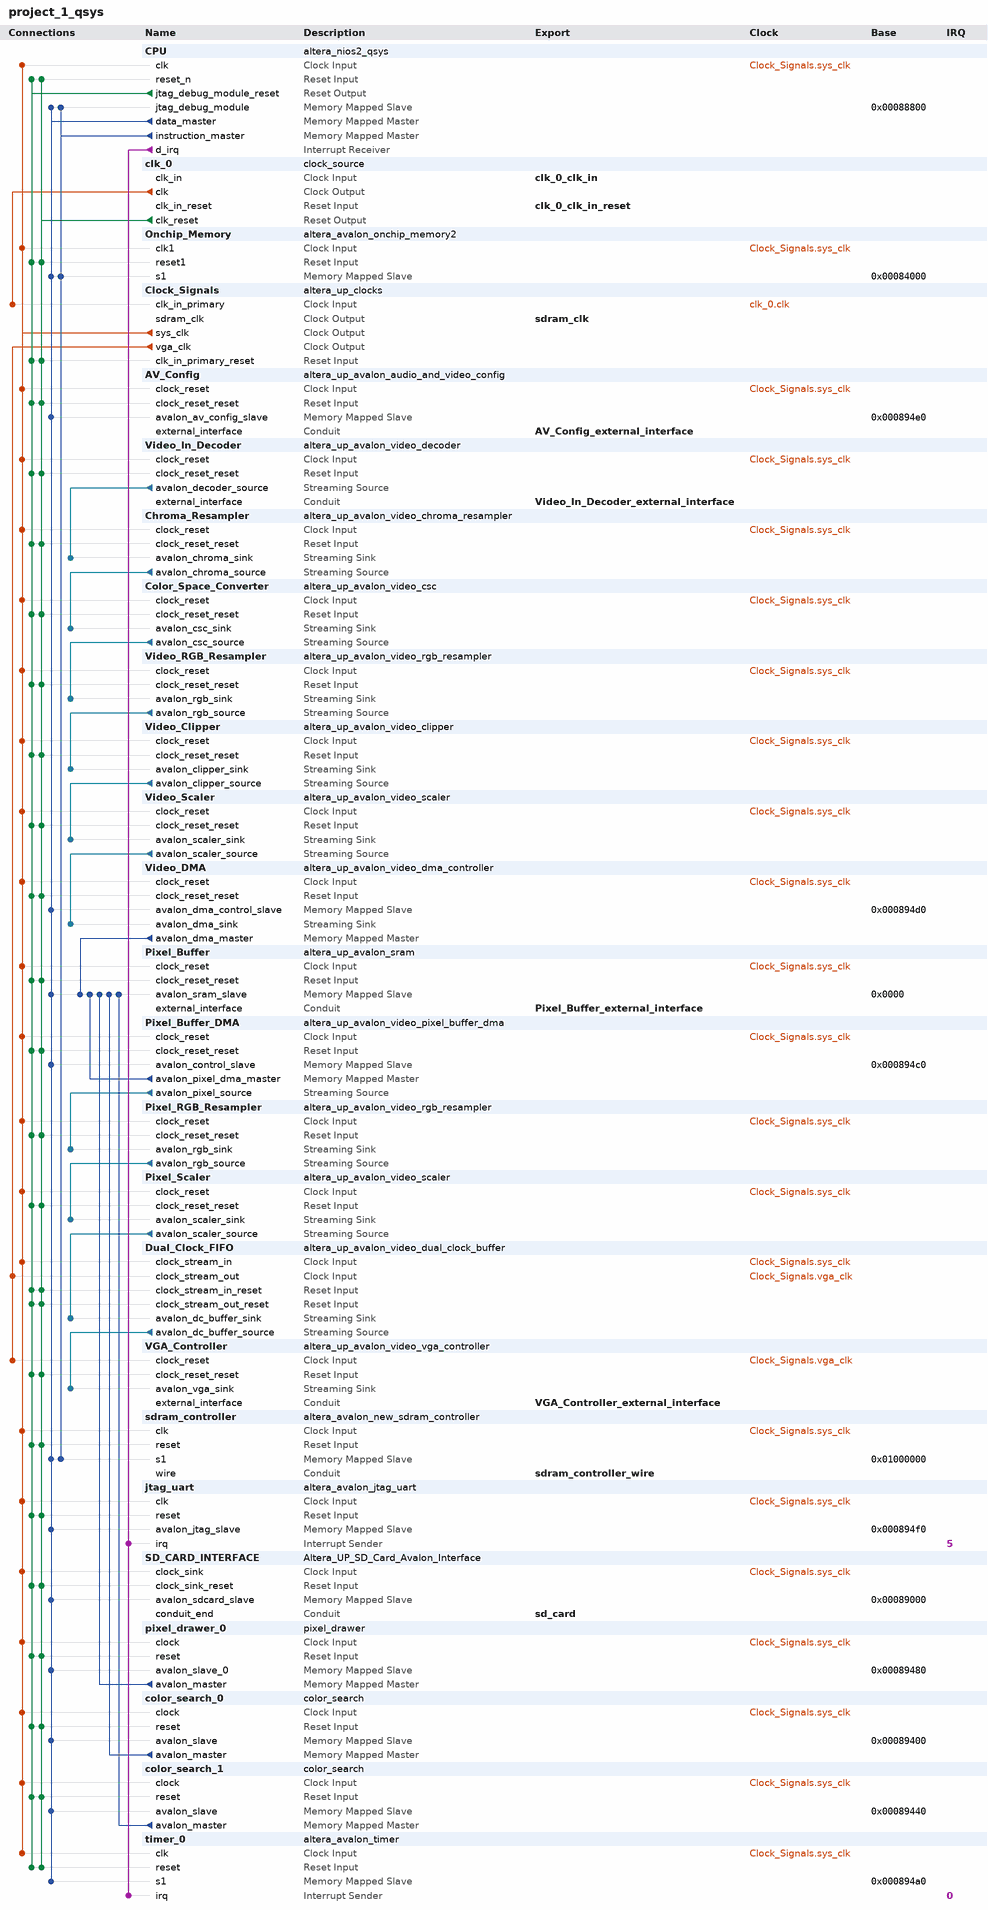
[diagram p0: system contents]
# Platform Designer (Qsys) system project_1_qsys, Cyclone II EP2C35F672C6
# Parameters at their usual value, and those the tool derives, are not listed.
package require -exact qsys 13.0
create_system project_1_qsys
set_project_property DEVICE_FAMILY {Cyclone II}
set_project_property DEVICE EP2C35F672C6

add_instance CPU altera_nios2_qsys 13.0
set_instance_parameter_value CPU manuallyAssignCpuID false
set_instance_parameter_value CPU resetSlave sdram_controller.s1
set_instance_parameter_value CPU exceptionSlave sdram_controller.s1
set_instance_parameter_value CPU breakSlave CPU.jtag_debug_module
set_instance_parameter_value CPU impl Fast
set_instance_parameter_value CPU icache_size 4096

add_instance clk_0 clock_source 13.0
set_instance_parameter_value clk_0 clockFrequency 50000000

add_instance Onchip_Memory altera_avalon_onchip_memory2 13.0.1.99.2
set_instance_parameter_value Onchip_Memory dataWidth 32
set_instance_parameter_value Onchip_Memory dualPort false
set_instance_parameter_value Onchip_Memory initMemContent true
set_instance_parameter_value Onchip_Memory initializationFileName Onchip_Memory
set_instance_parameter_value Onchip_Memory memorySize 16384

add_instance Clock_Signals altera_up_clocks 13.0
set_instance_parameter_value Clock_Signals board DE2
set_instance_parameter_value Clock_Signals vga_clk true
set_instance_parameter_value Clock_Signals audio_clk false
set_instance_parameter_value Clock_Signals audio_clk_freq 12.288

add_instance AV_Config altera_up_avalon_audio_and_video_config 13.0
set_instance_parameter_value AV_Config board DE2
set_instance_parameter_value AV_Config audio_in {Microphone to ADC}
set_instance_parameter_value AV_Config line_in_bypass false
set_instance_parameter_value AV_Config bit_length 24
set_instance_parameter_value AV_Config sampling_rate {48 kHz}

add_instance Video_In_Decoder altera_up_avalon_video_decoder 13.0

add_instance Chroma_Resampler altera_up_avalon_video_chroma_resampler 13.0

add_instance Color_Space_Converter altera_up_avalon_video_csc 13.0

add_instance Video_RGB_Resampler altera_up_avalon_video_rgb_resampler 13.0
set_instance_parameter_value Video_RGB_Resampler input_type {24-bit RGB}
set_instance_parameter_value Video_RGB_Resampler output_type {16-bit RGB}
set_instance_parameter_value Video_RGB_Resampler alpha 255

add_instance Video_Clipper altera_up_avalon_video_clipper 13.0
set_instance_parameter_value Video_Clipper color_bits 16
set_instance_parameter_value Video_Clipper color_planes 1

add_instance Video_Scaler altera_up_avalon_video_scaler 13.0
set_instance_parameter_value Video_Scaler width_scaling 0.5
set_instance_parameter_value Video_Scaler height_scaling 1
set_instance_parameter_value Video_Scaler width_in 640
set_instance_parameter_value Video_Scaler color_bits 16
set_instance_parameter_value Video_Scaler color_planes 1

add_instance Video_DMA altera_up_avalon_video_dma_controller 13.0
set_instance_parameter_value Video_DMA mode {From Stream to Memory}
set_instance_parameter_value Video_DMA addr_mode X-Y
set_instance_parameter_value Video_DMA start_address 0
set_instance_parameter_value Video_DMA back_start_address 0
set_instance_parameter_value Video_DMA width 320
set_instance_parameter_value Video_DMA height 240
set_instance_parameter_value Video_DMA color_bits 16
set_instance_parameter_value Video_DMA color_planes 1
set_instance_parameter_value Video_DMA dma_enabled true

add_instance Pixel_Buffer altera_up_avalon_sram 13.0
set_instance_parameter_value Pixel_Buffer board DE2
set_instance_parameter_value Pixel_Buffer pixel_buffer true

add_instance Pixel_Buffer_DMA altera_up_avalon_video_pixel_buffer_dma 13.0
set_instance_parameter_value Pixel_Buffer_DMA addr_mode X-Y
set_instance_parameter_value Pixel_Buffer_DMA start_address 0
set_instance_parameter_value Pixel_Buffer_DMA back_start_address 0
set_instance_parameter_value Pixel_Buffer_DMA image_width 320
set_instance_parameter_value Pixel_Buffer_DMA image_height 240
set_instance_parameter_value Pixel_Buffer_DMA color_space {16-bit RGB}

add_instance Pixel_RGB_Resampler altera_up_avalon_video_rgb_resampler 13.0
set_instance_parameter_value Pixel_RGB_Resampler input_type {16-bit RGB}
set_instance_parameter_value Pixel_RGB_Resampler output_type {30-bit RGB}
set_instance_parameter_value Pixel_RGB_Resampler alpha 255

add_instance Pixel_Scaler altera_up_avalon_video_scaler 13.0
set_instance_parameter_value Pixel_Scaler width_scaling 2
set_instance_parameter_value Pixel_Scaler height_scaling 2
set_instance_parameter_value Pixel_Scaler width_in 320
set_instance_parameter_value Pixel_Scaler color_bits 10
set_instance_parameter_value Pixel_Scaler color_planes 3

add_instance Dual_Clock_FIFO altera_up_avalon_video_dual_clock_buffer 13.0
set_instance_parameter_value Dual_Clock_FIFO color_bits 10

add_instance VGA_Controller altera_up_avalon_video_vga_controller 13.0
set_instance_parameter_value VGA_Controller board DE2

add_instance sdram_controller altera_avalon_new_sdram_controller 13.0.1.99.2
set_instance_parameter_value sdram_controller TAC 5.5
set_instance_parameter_value sdram_controller TRCD 20.0
set_instance_parameter_value sdram_controller TRP 20.0
set_instance_parameter_value sdram_controller casLatency 3
set_instance_parameter_value sdram_controller columnWidth 8
set_instance_parameter_value sdram_controller dataWidth 16
set_instance_parameter_value sdram_controller generateSimulationModel false
set_instance_parameter_value sdram_controller model single_Micron_MT48LC4M32B2_7_chip
set_instance_parameter_value sdram_controller numberOfBanks 4
set_instance_parameter_value sdram_controller numberOfChipSelects 1
set_instance_parameter_value sdram_controller powerUpDelay 100.0
set_instance_parameter_value sdram_controller refreshPeriod 15.625
set_instance_parameter_value sdram_controller rowWidth 12

add_instance jtag_uart altera_avalon_jtag_uart 13.0.1.99.2
set_instance_parameter_value jtag_uart simInteractiveOptions NO_INTERACTIVE_WINDOWS

add_instance SD_CARD_INTERFACE Altera_UP_SD_Card_Avalon_Interface 13.0

add_instance pixel_drawer_0 pixel_drawer 1.0
set_instance_parameter_value pixel_drawer_0 pixel_buffer_base 0

add_instance color_search_0 color_search 1.0
set_instance_parameter_value color_search_0 pixel_buffer_base 0
set_instance_parameter_value color_search_0 find_color 0
set_instance_parameter_value color_search_0 block_size 2
set_instance_parameter_value color_search_0 score_factor 2

add_instance color_search_1 color_search 1.0
set_instance_parameter_value color_search_1 pixel_buffer_base 0
set_instance_parameter_value color_search_1 find_color 2
set_instance_parameter_value color_search_1 block_size 2
set_instance_parameter_value color_search_1 score_factor 2

add_instance timer_0 altera_avalon_timer 13.0.1.99.2
set_instance_parameter_value timer_0 period 1
set_instance_parameter_value timer_0 periodUnits MSEC

# connections
add_connection clk_0.clk Clock_Signals.clk_in_primary clock
add_connection Clock_Signals.sys_clk AV_Config.clock_reset clock
add_connection Clock_Signals.sys_clk Chroma_Resampler.clock_reset clock
add_connection Clock_Signals.sys_clk color_search_0.clock clock
add_connection Clock_Signals.sys_clk color_search_1.clock clock
add_connection Clock_Signals.sys_clk Color_Space_Converter.clock_reset clock
add_connection Clock_Signals.sys_clk CPU.clk clock
add_connection Clock_Signals.sys_clk Dual_Clock_FIFO.clock_stream_in clock
add_connection Clock_Signals.sys_clk jtag_uart.clk clock
add_connection Clock_Signals.sys_clk Onchip_Memory.clk1 clock
add_connection Clock_Signals.sys_clk Pixel_Buffer.clock_reset clock
add_connection Clock_Signals.sys_clk Pixel_Buffer_DMA.clock_reset clock
add_connection Clock_Signals.sys_clk pixel_drawer_0.clock clock
add_connection Clock_Signals.sys_clk Pixel_RGB_Resampler.clock_reset clock
add_connection Clock_Signals.sys_clk Pixel_Scaler.clock_reset clock
add_connection Clock_Signals.sys_clk SD_CARD_INTERFACE.clock_sink clock
add_connection Clock_Signals.sys_clk sdram_controller.clk clock
add_connection Clock_Signals.sys_clk timer_0.clk clock
add_connection Clock_Signals.sys_clk Video_Clipper.clock_reset clock
add_connection Clock_Signals.sys_clk Video_DMA.clock_reset clock
add_connection Clock_Signals.sys_clk Video_In_Decoder.clock_reset clock
add_connection Clock_Signals.sys_clk Video_RGB_Resampler.clock_reset clock
add_connection Clock_Signals.sys_clk Video_Scaler.clock_reset clock
add_connection Clock_Signals.vga_clk Dual_Clock_FIFO.clock_stream_out clock
add_connection Clock_Signals.vga_clk VGA_Controller.clock_reset clock
add_connection clk_0.clk_reset AV_Config.clock_reset_reset reset
add_connection clk_0.clk_reset Chroma_Resampler.clock_reset_reset reset
add_connection clk_0.clk_reset Clock_Signals.clk_in_primary_reset reset
add_connection clk_0.clk_reset color_search_0.reset reset
add_connection clk_0.clk_reset color_search_1.reset reset
add_connection clk_0.clk_reset Color_Space_Converter.clock_reset_reset reset
add_connection clk_0.clk_reset CPU.reset_n reset
add_connection clk_0.clk_reset Dual_Clock_FIFO.clock_stream_in_reset reset
add_connection clk_0.clk_reset Dual_Clock_FIFO.clock_stream_out_reset reset
add_connection clk_0.clk_reset jtag_uart.reset reset
add_connection clk_0.clk_reset Onchip_Memory.reset1 reset
add_connection clk_0.clk_reset Pixel_Buffer.clock_reset_reset reset
add_connection clk_0.clk_reset Pixel_Buffer_DMA.clock_reset_reset reset
add_connection clk_0.clk_reset pixel_drawer_0.reset reset
add_connection clk_0.clk_reset Pixel_RGB_Resampler.clock_reset_reset reset
add_connection clk_0.clk_reset Pixel_Scaler.clock_reset_reset reset
add_connection clk_0.clk_reset SD_CARD_INTERFACE.clock_sink_reset reset
add_connection clk_0.clk_reset sdram_controller.reset reset
add_connection clk_0.clk_reset timer_0.reset reset
add_connection clk_0.clk_reset VGA_Controller.clock_reset_reset reset
add_connection clk_0.clk_reset Video_Clipper.clock_reset_reset reset
add_connection clk_0.clk_reset Video_DMA.clock_reset_reset reset
add_connection clk_0.clk_reset Video_In_Decoder.clock_reset_reset reset
add_connection clk_0.clk_reset Video_RGB_Resampler.clock_reset_reset reset
add_connection clk_0.clk_reset Video_Scaler.clock_reset_reset reset
add_connection CPU.jtag_debug_module_reset AV_Config.clock_reset_reset reset
add_connection CPU.jtag_debug_module_reset Chroma_Resampler.clock_reset_reset reset
add_connection CPU.jtag_debug_module_reset Clock_Signals.clk_in_primary_reset reset
add_connection CPU.jtag_debug_module_reset color_search_0.reset reset
add_connection CPU.jtag_debug_module_reset color_search_1.reset reset
add_connection CPU.jtag_debug_module_reset Color_Space_Converter.clock_reset_reset reset
add_connection CPU.jtag_debug_module_reset CPU.reset_n reset
add_connection CPU.jtag_debug_module_reset Dual_Clock_FIFO.clock_stream_in_reset reset
add_connection CPU.jtag_debug_module_reset Dual_Clock_FIFO.clock_stream_out_reset reset
add_connection CPU.jtag_debug_module_reset jtag_uart.reset reset
add_connection CPU.jtag_debug_module_reset Onchip_Memory.reset1 reset
add_connection CPU.jtag_debug_module_reset Pixel_Buffer.clock_reset_reset reset
add_connection CPU.jtag_debug_module_reset Pixel_Buffer_DMA.clock_reset_reset reset
add_connection CPU.jtag_debug_module_reset pixel_drawer_0.reset reset
add_connection CPU.jtag_debug_module_reset Pixel_RGB_Resampler.clock_reset_reset reset
add_connection CPU.jtag_debug_module_reset Pixel_Scaler.clock_reset_reset reset
add_connection CPU.jtag_debug_module_reset SD_CARD_INTERFACE.clock_sink_reset reset
add_connection CPU.jtag_debug_module_reset sdram_controller.reset reset
add_connection CPU.jtag_debug_module_reset timer_0.reset reset
add_connection CPU.jtag_debug_module_reset VGA_Controller.clock_reset_reset reset
add_connection CPU.jtag_debug_module_reset Video_Clipper.clock_reset_reset reset
add_connection CPU.jtag_debug_module_reset Video_DMA.clock_reset_reset reset
add_connection CPU.jtag_debug_module_reset Video_In_Decoder.clock_reset_reset reset
add_connection CPU.jtag_debug_module_reset Video_RGB_Resampler.clock_reset_reset reset
add_connection CPU.jtag_debug_module_reset Video_Scaler.clock_reset_reset reset
add_connection color_search_0.avalon_master Pixel_Buffer.avalon_sram_slave avalon
set_connection_parameter_value color_search_0.avalon_master/Pixel_Buffer.avalon_sram_slave baseAddress 0x0000
add_connection color_search_1.avalon_master Pixel_Buffer.avalon_sram_slave avalon
set_connection_parameter_value color_search_1.avalon_master/Pixel_Buffer.avalon_sram_slave baseAddress 0x0000
add_connection CPU.data_master AV_Config.avalon_av_config_slave avalon
set_connection_parameter_value CPU.data_master/AV_Config.avalon_av_config_slave baseAddress 0x000894e0
add_connection CPU.data_master color_search_0.avalon_slave avalon
set_connection_parameter_value CPU.data_master/color_search_0.avalon_slave baseAddress 0x00089400
add_connection CPU.data_master color_search_1.avalon_slave avalon
set_connection_parameter_value CPU.data_master/color_search_1.avalon_slave baseAddress 0x00089440
add_connection CPU.data_master CPU.jtag_debug_module avalon
set_connection_parameter_value CPU.data_master/CPU.jtag_debug_module baseAddress 0x00088800
add_connection CPU.data_master jtag_uart.avalon_jtag_slave avalon
set_connection_parameter_value CPU.data_master/jtag_uart.avalon_jtag_slave baseAddress 0x000894f0
add_connection CPU.data_master Onchip_Memory.s1 avalon
set_connection_parameter_value CPU.data_master/Onchip_Memory.s1 baseAddress 0x00084000
add_connection CPU.data_master Pixel_Buffer.avalon_sram_slave avalon
set_connection_parameter_value CPU.data_master/Pixel_Buffer.avalon_sram_slave baseAddress 0x0000
add_connection CPU.data_master Pixel_Buffer_DMA.avalon_control_slave avalon
set_connection_parameter_value CPU.data_master/Pixel_Buffer_DMA.avalon_control_slave baseAddress 0x000894c0
add_connection CPU.data_master pixel_drawer_0.avalon_slave_0 avalon
set_connection_parameter_value CPU.data_master/pixel_drawer_0.avalon_slave_0 baseAddress 0x00089480
add_connection CPU.data_master SD_CARD_INTERFACE.avalon_sdcard_slave avalon
set_connection_parameter_value CPU.data_master/SD_CARD_INTERFACE.avalon_sdcard_slave baseAddress 0x00089000
add_connection CPU.data_master sdram_controller.s1 avalon
set_connection_parameter_value CPU.data_master/sdram_controller.s1 baseAddress 0x01000000
add_connection CPU.data_master timer_0.s1 avalon
set_connection_parameter_value CPU.data_master/timer_0.s1 baseAddress 0x000894a0
add_connection CPU.data_master Video_DMA.avalon_dma_control_slave avalon
set_connection_parameter_value CPU.data_master/Video_DMA.avalon_dma_control_slave baseAddress 0x000894d0
add_connection CPU.instruction_master CPU.jtag_debug_module avalon
set_connection_parameter_value CPU.instruction_master/CPU.jtag_debug_module baseAddress 0x00088800
add_connection CPU.instruction_master Onchip_Memory.s1 avalon
set_connection_parameter_value CPU.instruction_master/Onchip_Memory.s1 baseAddress 0x00084000
add_connection CPU.instruction_master sdram_controller.s1 avalon
set_connection_parameter_value CPU.instruction_master/sdram_controller.s1 baseAddress 0x01000000
add_connection Pixel_Buffer_DMA.avalon_pixel_dma_master Pixel_Buffer.avalon_sram_slave avalon
set_connection_parameter_value Pixel_Buffer_DMA.avalon_pixel_dma_master/Pixel_Buffer.avalon_sram_slave baseAddress 0x0000
add_connection pixel_drawer_0.avalon_master Pixel_Buffer.avalon_sram_slave avalon
set_connection_parameter_value pixel_drawer_0.avalon_master/Pixel_Buffer.avalon_sram_slave baseAddress 0x0000
add_connection Video_DMA.avalon_dma_master Pixel_Buffer.avalon_sram_slave avalon
set_connection_parameter_value Video_DMA.avalon_dma_master/Pixel_Buffer.avalon_sram_slave baseAddress 0x0000
add_connection Chroma_Resampler.avalon_chroma_source Color_Space_Converter.avalon_csc_sink avalon_streaming
add_connection Color_Space_Converter.avalon_csc_source Video_RGB_Resampler.avalon_rgb_sink avalon_streaming
add_connection Dual_Clock_FIFO.avalon_dc_buffer_source VGA_Controller.avalon_vga_sink avalon_streaming
add_connection Pixel_Buffer_DMA.avalon_pixel_source Pixel_RGB_Resampler.avalon_rgb_sink avalon_streaming
add_connection Pixel_RGB_Resampler.avalon_rgb_source Pixel_Scaler.avalon_scaler_sink avalon_streaming
add_connection Pixel_Scaler.avalon_scaler_source Dual_Clock_FIFO.avalon_dc_buffer_sink avalon_streaming
add_connection Video_Clipper.avalon_clipper_source Video_Scaler.avalon_scaler_sink avalon_streaming
add_connection Video_In_Decoder.avalon_decoder_source Chroma_Resampler.avalon_chroma_sink avalon_streaming
add_connection Video_RGB_Resampler.avalon_rgb_source Video_Clipper.avalon_clipper_sink avalon_streaming
add_connection Video_Scaler.avalon_scaler_source Video_DMA.avalon_dma_sink avalon_streaming
add_connection CPU.d_irq jtag_uart.irq interrupt
set_connection_parameter_value CPU.d_irq/jtag_uart.irq irqNumber 5
add_connection CPU.d_irq timer_0.irq interrupt
set_connection_parameter_value CPU.d_irq/timer_0.irq irqNumber 0

# exported interfaces
add_interface VGA_Controller_external_interface conduit end
set_interface_property VGA_Controller_external_interface EXPORT_OF VGA_Controller.external_interface
add_interface clk_0_clk_in clock sink
set_interface_property clk_0_clk_in EXPORT_OF clk_0.clk_in
add_interface clk_0_clk_in_reset reset sink
set_interface_property clk_0_clk_in_reset EXPORT_OF clk_0.clk_in_reset
add_interface AV_Config_external_interface conduit end
set_interface_property AV_Config_external_interface EXPORT_OF AV_Config.external_interface
add_interface Pixel_Buffer_external_interface conduit end
set_interface_property Pixel_Buffer_external_interface EXPORT_OF Pixel_Buffer.external_interface
add_interface Video_In_Decoder_external_interface conduit end
set_interface_property Video_In_Decoder_external_interface EXPORT_OF Video_In_Decoder.external_interface
add_interface sdram_controller_wire conduit end
set_interface_property sdram_controller_wire EXPORT_OF sdram_controller.wire
add_interface sdram_clk clock source
set_interface_property sdram_clk EXPORT_OF Clock_Signals.sdram_clk
add_interface sd_card conduit end
set_interface_property sd_card EXPORT_OF SD_CARD_INTERFACE.conduit_end

set_interconnect_requirement {$system} qsys_mm.clockCrossingAdapter HANDSHAKE
set_interconnect_requirement {$system} qsys_mm.maxAdditionalLatency 0

save_system project_1_qsys.qsys
